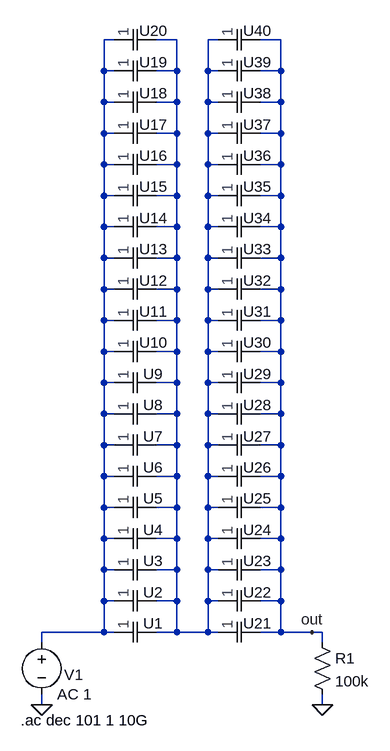
[diagram p0: schematic 08-dc_filter.asc]
08-dc_filter.asc, the LTspice schematic file:
Version 4
SHEET 1 880 680
WIRE -16 -752 -32 -752
WIRE 80 -752 48 -752
WIRE 144 -752 128 -752
WIRE 240 -752 208 -752
WIRE -32 -704 -32 -752
WIRE -16 -704 -32 -704
WIRE 80 -704 80 -752
WIRE 80 -704 48 -704
WIRE 128 -704 128 -752
WIRE 144 -704 128 -704
WIRE 240 -704 240 -752
WIRE 240 -704 208 -704
WIRE -32 -656 -32 -704
WIRE -16 -656 -32 -656
WIRE 80 -656 80 -704
WIRE 80 -656 48 -656
WIRE 128 -656 128 -704
WIRE 144 -656 128 -656
WIRE 240 -656 240 -704
WIRE 240 -656 208 -656
WIRE -32 -608 -32 -656
WIRE -16 -608 -32 -608
WIRE 80 -608 80 -656
WIRE 80 -608 48 -608
WIRE 128 -608 128 -656
WIRE 144 -608 128 -608
WIRE 240 -608 240 -656
WIRE 240 -608 208 -608
WIRE -32 -560 -32 -608
WIRE -16 -560 -32 -560
WIRE 80 -560 80 -608
WIRE 80 -560 48 -560
WIRE 128 -560 128 -608
WIRE 144 -560 128 -560
WIRE 240 -560 240 -608
WIRE 240 -560 208 -560
WIRE -32 -512 -32 -560
WIRE -16 -512 -32 -512
WIRE 80 -512 80 -560
WIRE 80 -512 48 -512
WIRE 128 -512 128 -560
WIRE 144 -512 128 -512
WIRE 240 -512 240 -560
WIRE 240 -512 208 -512
WIRE -32 -464 -32 -512
WIRE -16 -464 -32 -464
WIRE 80 -464 80 -512
WIRE 80 -464 48 -464
WIRE 128 -464 128 -512
WIRE 144 -464 128 -464
WIRE 240 -464 240 -512
WIRE 240 -464 208 -464
WIRE -32 -416 -32 -464
WIRE -16 -416 -32 -416
WIRE 80 -416 80 -464
WIRE 80 -416 48 -416
WIRE 128 -416 128 -464
WIRE 144 -416 128 -416
WIRE 240 -416 240 -464
WIRE 240 -416 208 -416
WIRE -32 -368 -32 -416
WIRE -16 -368 -32 -368
WIRE 80 -368 80 -416
WIRE 80 -368 48 -368
WIRE 128 -368 128 -416
WIRE 144 -368 128 -368
WIRE 240 -368 240 -416
WIRE 240 -368 208 -368
WIRE -32 -320 -32 -368
WIRE -16 -320 -32 -320
WIRE 80 -320 80 -368
WIRE 80 -320 48 -320
WIRE 128 -320 128 -368
WIRE 144 -320 128 -320
WIRE 240 -320 240 -368
WIRE 240 -320 208 -320
WIRE -32 -272 -32 -320
WIRE -16 -272 -32 -272
WIRE 80 -272 80 -320
WIRE 80 -272 48 -272
WIRE 128 -272 128 -320
WIRE 144 -272 128 -272
WIRE 240 -272 240 -320
WIRE 240 -272 208 -272
WIRE -32 -224 -32 -272
WIRE -16 -224 -32 -224
WIRE 80 -224 80 -272
WIRE 80 -224 48 -224
WIRE 128 -224 128 -272
WIRE 144 -224 128 -224
WIRE 240 -224 240 -272
WIRE 240 -224 208 -224
WIRE -32 -176 -32 -224
WIRE -16 -176 -32 -176
WIRE 80 -176 80 -224
WIRE 80 -176 48 -176
WIRE 128 -176 128 -224
WIRE 144 -176 128 -176
WIRE 240 -176 240 -224
WIRE 240 -176 208 -176
WIRE -32 -128 -32 -176
WIRE -16 -128 -32 -128
WIRE 80 -128 80 -176
WIRE 80 -128 48 -128
WIRE 128 -128 128 -176
WIRE 144 -128 128 -128
WIRE 240 -128 240 -176
WIRE 240 -128 208 -128
WIRE -32 -80 -32 -128
WIRE -16 -80 -32 -80
WIRE 80 -80 80 -128
WIRE 80 -80 48 -80
WIRE 128 -80 128 -128
WIRE 144 -80 128 -80
WIRE 240 -80 240 -128
WIRE 240 -80 208 -80
WIRE -32 -32 -32 -80
WIRE -16 -32 -32 -32
WIRE 80 -32 80 -80
WIRE 80 -32 48 -32
WIRE 128 -32 128 -80
WIRE 144 -32 128 -32
WIRE 240 -32 240 -80
WIRE 240 -32 208 -32
WIRE -32 16 -32 -32
WIRE -16 16 -32 16
WIRE 80 16 80 -32
WIRE 80 16 48 16
WIRE 128 16 128 -32
WIRE 144 16 128 16
WIRE 240 16 240 -32
WIRE 240 16 208 16
WIRE -32 64 -32 16
WIRE -16 64 -32 64
WIRE 80 64 80 16
WIRE 80 64 48 64
WIRE 128 64 128 16
WIRE 144 64 128 64
WIRE 240 64 240 16
WIRE 240 64 208 64
WIRE -32 112 -32 64
WIRE -16 112 -32 112
WIRE 80 112 80 64
WIRE 80 112 48 112
WIRE 128 112 128 64
WIRE 144 112 128 112
WIRE 240 112 240 64
WIRE 240 112 208 112
WIRE -32 160 -32 112
WIRE -32 160 -128 160
WIRE -16 160 -32 160
WIRE 80 160 80 112
WIRE 80 160 48 160
WIRE 128 160 128 112
WIRE 128 160 80 160
WIRE 144 160 128 160
WIRE 240 160 240 112
WIRE 240 160 208 160
WIRE 288 160 240 160
WIRE 304 160 288 160
WIRE -128 176 -128 160
WIRE 304 176 304 160
WIRE -128 272 -128 256
WIRE 304 272 304 256
FLAG -128 272 0
FLAG 304 272 0
FLAG 288 160 out
SYMBOL GRM31C5C1H224GE02_DC0V_25degC 16 160 R270
WINDOW 0 -2 28 VTop 2
WINDOW 3 -17 -24 Invisible 0
SYMATTR InstName U1
SYMBOL voltage -128 160 R0
WINDOW 0 35 66 Left 2
SYMATTR InstName V1
SYMATTR Value AC 1
SYMBOL res 288 160 R0
SYMATTR InstName R1
SYMATTR Value 100k
SYMBOL GRM31C5C1H224GE02_DC0V_25degC 16 112 R270
WINDOW 0 -2 28 VTop 2
WINDOW 3 -17 -24 Invisible 0
SYMATTR InstName U2
SYMBOL GRM31C5C1H224GE02_DC0V_25degC 16 64 R270
WINDOW 0 -2 28 VTop 2
WINDOW 3 -17 -24 Invisible 0
SYMATTR InstName U3
SYMBOL GRM31C5C1H224GE02_DC0V_25degC 16 16 R270
WINDOW 0 -2 28 VTop 2
WINDOW 3 -17 -24 Invisible 0
SYMATTR InstName U4
SYMBOL GRM31C5C1H224GE02_DC0V_25degC 16 -32 R270
WINDOW 0 -2 28 VTop 2
WINDOW 3 -17 -24 Invisible 0
SYMATTR InstName U5
SYMBOL GRM31C5C1H224GE02_DC0V_25degC 16 -80 R270
WINDOW 0 -2 28 VTop 2
WINDOW 3 -17 -24 Invisible 0
SYMATTR InstName U6
SYMBOL GRM31C5C1H224GE02_DC0V_25degC 16 -128 R270
WINDOW 0 -2 28 VTop 2
WINDOW 3 -17 -24 Invisible 0
SYMATTR InstName U7
SYMBOL GRM31C5C1H224GE02_DC0V_25degC 16 -176 R270
WINDOW 0 -2 28 VTop 2
WINDOW 3 -17 -24 Invisible 0
SYMATTR InstName U8
SYMBOL GRM31C5C1H224GE02_DC0V_25degC 16 -224 R270
WINDOW 0 -2 28 VTop 2
WINDOW 3 -17 -24 Invisible 0
SYMATTR InstName U9
SYMBOL GRM31C5C1H224GE02_DC0V_25degC 16 -272 R270
WINDOW 0 -2 28 VTop 2
WINDOW 3 -17 -24 Invisible 0
SYMATTR InstName U10
SYMBOL GRM31C5C1H224GE02_DC0V_25degC 16 -320 R270
WINDOW 0 -2 28 VTop 2
WINDOW 3 -17 -24 Invisible 0
SYMATTR InstName U11
SYMBOL GRM31C5C1H224GE02_DC0V_25degC 16 -368 R270
WINDOW 0 -2 28 VTop 2
WINDOW 3 -17 -24 Invisible 0
SYMATTR InstName U12
SYMBOL GRM31C5C1H224GE02_DC0V_25degC 16 -416 R270
WINDOW 0 -2 28 VTop 2
WINDOW 3 -17 -24 Invisible 0
SYMATTR InstName U13
SYMBOL GRM31C5C1H224GE02_DC0V_25degC 16 -464 R270
WINDOW 0 -2 28 VTop 2
WINDOW 3 -17 -24 Invisible 0
SYMATTR InstName U14
SYMBOL GRM31C5C1H224GE02_DC0V_25degC 16 -512 R270
WINDOW 0 -2 28 VTop 2
WINDOW 3 -17 -24 Invisible 0
SYMATTR InstName U15
SYMBOL GRM31C5C1H224GE02_DC0V_25degC 16 -560 R270
WINDOW 0 -2 28 VTop 2
WINDOW 3 -17 -24 Invisible 0
SYMATTR InstName U16
SYMBOL GRM31C5C1H224GE02_DC0V_25degC 16 -608 R270
WINDOW 0 -2 28 VTop 2
WINDOW 3 -17 -24 Invisible 0
SYMATTR InstName U17
SYMBOL GRM31C5C1H224GE02_DC0V_25degC 16 -656 R270
WINDOW 0 -2 28 VTop 2
WINDOW 3 -17 -24 Invisible 0
SYMATTR InstName U18
SYMBOL GRM31C5C1H224GE02_DC0V_25degC 16 -704 R270
WINDOW 0 -2 28 VTop 2
WINDOW 3 -17 -24 Invisible 0
SYMATTR InstName U19
SYMBOL GRM31C5C1H224GE02_DC0V_25degC 16 -752 R270
WINDOW 0 -2 28 VTop 2
WINDOW 3 -17 -24 Invisible 0
SYMATTR InstName U20
SYMBOL GRM31C5C1H224GE02_DC0V_25degC 176 160 R270
WINDOW 0 -2 28 VTop 2
WINDOW 3 -17 -24 Invisible 0
SYMATTR InstName U21
SYMBOL GRM31C5C1H224GE02_DC0V_25degC 176 112 R270
WINDOW 0 -2 28 VTop 2
WINDOW 3 -17 -24 Invisible 0
SYMATTR InstName U22
SYMBOL GRM31C5C1H224GE02_DC0V_25degC 176 64 R270
WINDOW 0 -2 28 VTop 2
WINDOW 3 -17 -24 Invisible 0
SYMATTR InstName U23
SYMBOL GRM31C5C1H224GE02_DC0V_25degC 176 16 R270
WINDOW 0 -2 28 VTop 2
WINDOW 3 -17 -24 Invisible 0
SYMATTR InstName U24
SYMBOL GRM31C5C1H224GE02_DC0V_25degC 176 -32 R270
WINDOW 0 -2 28 VTop 2
WINDOW 3 -17 -24 Invisible 0
SYMATTR InstName U25
SYMBOL GRM31C5C1H224GE02_DC0V_25degC 176 -80 R270
WINDOW 0 -2 28 VTop 2
WINDOW 3 -17 -24 Invisible 0
SYMATTR InstName U26
SYMBOL GRM31C5C1H224GE02_DC0V_25degC 176 -128 R270
WINDOW 0 -2 28 VTop 2
WINDOW 3 -17 -24 Invisible 0
SYMATTR InstName U27
SYMBOL GRM31C5C1H224GE02_DC0V_25degC 176 -176 R270
WINDOW 0 -2 28 VTop 2
WINDOW 3 -17 -24 Invisible 0
SYMATTR InstName U28
SYMBOL GRM31C5C1H224GE02_DC0V_25degC 176 -224 R270
WINDOW 0 -2 28 VTop 2
WINDOW 3 -17 -24 Invisible 0
SYMATTR InstName U29
SYMBOL GRM31C5C1H224GE02_DC0V_25degC 176 -272 R270
WINDOW 0 -2 28 VTop 2
WINDOW 3 -17 -24 Invisible 0
SYMATTR InstName U30
SYMBOL GRM31C5C1H224GE02_DC0V_25degC 176 -320 R270
WINDOW 0 -2 28 VTop 2
WINDOW 3 -17 -24 Invisible 0
SYMATTR InstName U31
SYMBOL GRM31C5C1H224GE02_DC0V_25degC 176 -368 R270
WINDOW 0 -2 28 VTop 2
WINDOW 3 -17 -24 Invisible 0
SYMATTR InstName U32
SYMBOL GRM31C5C1H224GE02_DC0V_25degC 176 -416 R270
WINDOW 0 -2 28 VTop 2
WINDOW 3 -17 -24 Invisible 0
SYMATTR InstName U33
SYMBOL GRM31C5C1H224GE02_DC0V_25degC 176 -464 R270
WINDOW 0 -2 28 VTop 2
WINDOW 3 -17 -24 Invisible 0
SYMATTR InstName U34
SYMBOL GRM31C5C1H224GE02_DC0V_25degC 176 -512 R270
WINDOW 0 -2 28 VTop 2
WINDOW 3 -17 -24 Invisible 0
SYMATTR InstName U35
SYMBOL GRM31C5C1H224GE02_DC0V_25degC 176 -560 R270
WINDOW 0 -2 28 VTop 2
WINDOW 3 -17 -24 Invisible 0
SYMATTR InstName U36
SYMBOL GRM31C5C1H224GE02_DC0V_25degC 176 -608 R270
WINDOW 0 -2 28 VTop 2
WINDOW 3 -17 -24 Invisible 0
SYMATTR InstName U37
SYMBOL GRM31C5C1H224GE02_DC0V_25degC 176 -656 R270
WINDOW 0 -2 28 VTop 2
WINDOW 3 -17 -24 Invisible 0
SYMATTR InstName U38
SYMBOL GRM31C5C1H224GE02_DC0V_25degC 176 -704 R270
WINDOW 0 -2 28 VTop 2
WINDOW 3 -17 -24 Invisible 0
SYMATTR InstName U39
SYMBOL GRM31C5C1H224GE02_DC0V_25degC 176 -752 R270
WINDOW 0 -2 28 VTop 2
WINDOW 3 -17 -24 Invisible 0
SYMATTR InstName U40
TEXT -160 296 Left 2 !.ac dec 101 1 10G

The netlist it stands for:
* 08-dc_filter.asc
XU1 N001 N002 GRM31C5C1H224GE02_DC0V_25degC  ; pins port1 port2
V1 N001 0 AC 1
R1 out 0 100k
XU2 N001 N002 GRM31C5C1H224GE02_DC0V_25degC  ; pins port1 port2
XU3 N001 N002 GRM31C5C1H224GE02_DC0V_25degC  ; pins port1 port2
XU4 N001 N002 GRM31C5C1H224GE02_DC0V_25degC  ; pins port1 port2
XU5 N001 N002 GRM31C5C1H224GE02_DC0V_25degC  ; pins port1 port2
XU6 N001 N002 GRM31C5C1H224GE02_DC0V_25degC  ; pins port1 port2
XU7 N001 N002 GRM31C5C1H224GE02_DC0V_25degC  ; pins port1 port2
XU8 N001 N002 GRM31C5C1H224GE02_DC0V_25degC  ; pins port1 port2
XU9 N001 N002 GRM31C5C1H224GE02_DC0V_25degC  ; pins port1 port2
XU10 N001 N002 GRM31C5C1H224GE02_DC0V_25degC  ; pins port1 port2
XU11 N001 N002 GRM31C5C1H224GE02_DC0V_25degC  ; pins port1 port2
XU12 N001 N002 GRM31C5C1H224GE02_DC0V_25degC  ; pins port1 port2
XU13 N001 N002 GRM31C5C1H224GE02_DC0V_25degC  ; pins port1 port2
XU14 N001 N002 GRM31C5C1H224GE02_DC0V_25degC  ; pins port1 port2
XU15 N001 N002 GRM31C5C1H224GE02_DC0V_25degC  ; pins port1 port2
XU16 N001 N002 GRM31C5C1H224GE02_DC0V_25degC  ; pins port1 port2
XU17 N001 N002 GRM31C5C1H224GE02_DC0V_25degC  ; pins port1 port2
XU18 N001 N002 GRM31C5C1H224GE02_DC0V_25degC  ; pins port1 port2
XU19 N001 N002 GRM31C5C1H224GE02_DC0V_25degC  ; pins port1 port2
XU20 N001 N002 GRM31C5C1H224GE02_DC0V_25degC  ; pins port1 port2
XU21 N002 out GRM31C5C1H224GE02_DC0V_25degC  ; pins port1 port2
XU22 N002 out GRM31C5C1H224GE02_DC0V_25degC  ; pins port1 port2
XU23 N002 out GRM31C5C1H224GE02_DC0V_25degC  ; pins port1 port2
XU24 N002 out GRM31C5C1H224GE02_DC0V_25degC  ; pins port1 port2
XU25 N002 out GRM31C5C1H224GE02_DC0V_25degC  ; pins port1 port2
XU26 N002 out GRM31C5C1H224GE02_DC0V_25degC  ; pins port1 port2
XU27 N002 out GRM31C5C1H224GE02_DC0V_25degC  ; pins port1 port2
XU28 N002 out GRM31C5C1H224GE02_DC0V_25degC  ; pins port1 port2
XU29 N002 out GRM31C5C1H224GE02_DC0V_25degC  ; pins port1 port2
XU30 N002 out GRM31C5C1H224GE02_DC0V_25degC  ; pins port1 port2
XU31 N002 out GRM31C5C1H224GE02_DC0V_25degC  ; pins port1 port2
XU32 N002 out GRM31C5C1H224GE02_DC0V_25degC  ; pins port1 port2
XU33 N002 out GRM31C5C1H224GE02_DC0V_25degC  ; pins port1 port2
XU34 N002 out GRM31C5C1H224GE02_DC0V_25degC  ; pins port1 port2
XU35 N002 out GRM31C5C1H224GE02_DC0V_25degC  ; pins port1 port2
XU36 N002 out GRM31C5C1H224GE02_DC0V_25degC  ; pins port1 port2
XU37 N002 out GRM31C5C1H224GE02_DC0V_25degC  ; pins port1 port2
XU38 N002 out GRM31C5C1H224GE02_DC0V_25degC  ; pins port1 port2
XU39 N002 out GRM31C5C1H224GE02_DC0V_25degC  ; pins port1 port2
XU40 N002 out GRM31C5C1H224GE02_DC0V_25degC  ; pins port1 port2
.ac dec 101 1 10G
.lib C:\Users\s\Documents\GitHub\LTspice\12-capacitors\GRM31C5C1H224GE02_DC0V_25degC.mod
.backanno
.end

* Results of the author's LTspice run, read from the files saved beside the schematic
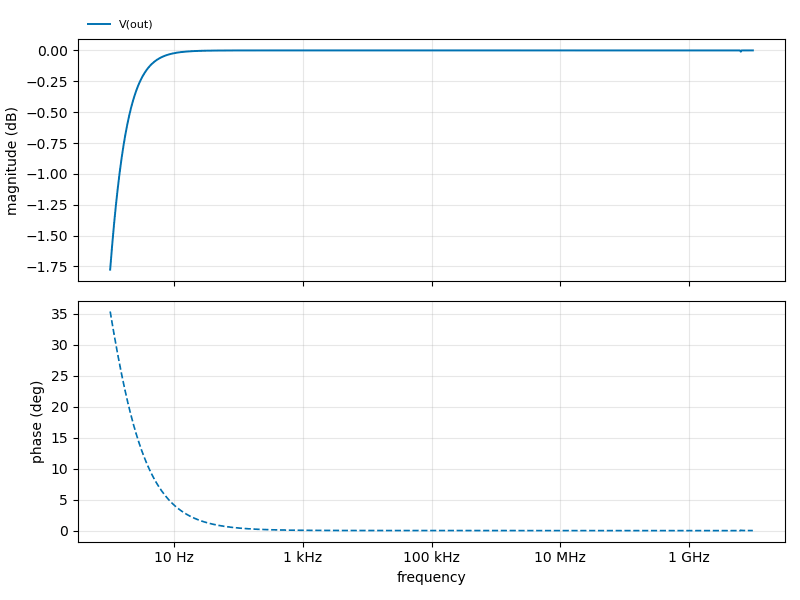
[diagram p1: AC Analysis of 08-dc_filter.asc, plotted from the saved traces]
* AC Analysis, 1 run:
*   V(out): -1.78 dB at 1 Hz, -0.00 dB at 10 GHz, peak -0.00 dB at 193.7 kHz